# EAGLE schematic APRS_TRacker_2 (EAGLE 7.3.0)
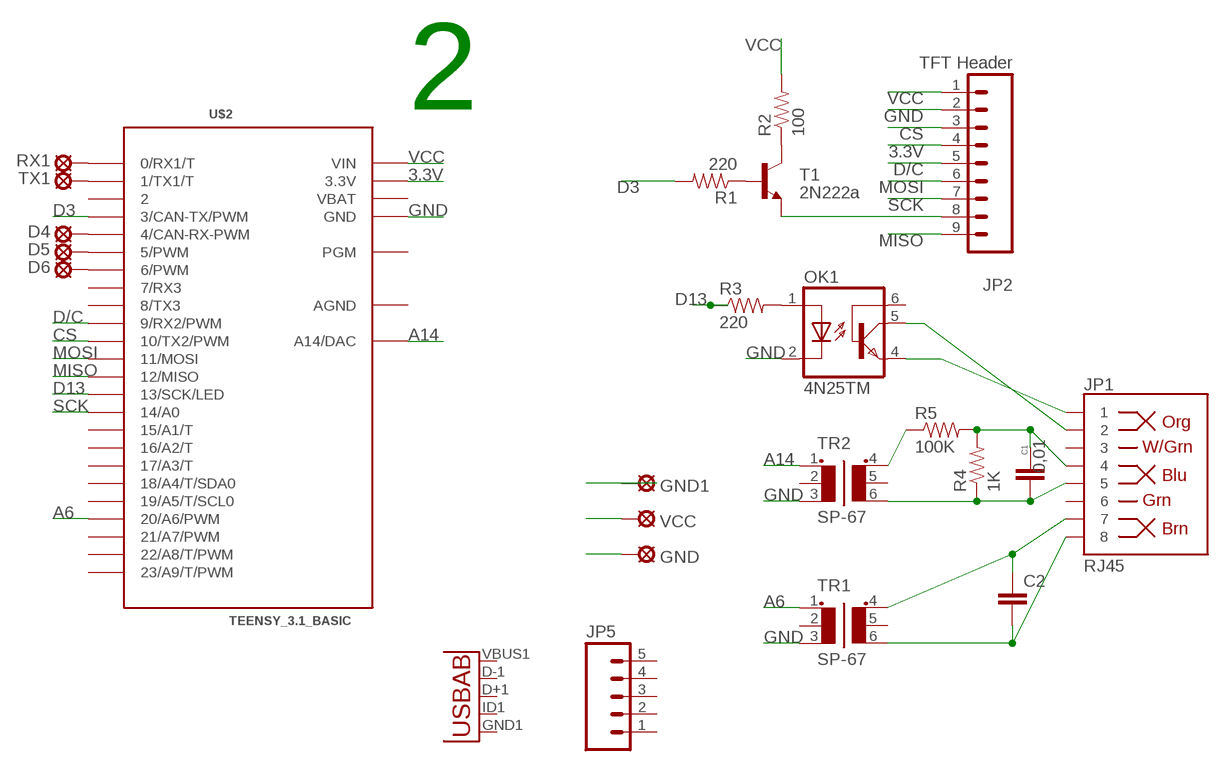
[diagram p0: schematic, sheet 1]

## Parts
C1  0,01  CAPPTH2  [CAP-PTH-SMALL2]
C2  CAPPTH2  [CAP-PTH-SMALL2]
D4  LSP10  [LSP10]
D5  LSP10  [LSP10]
D6  LSP10  [LSP10]
GND  LSP10  [LSP10]
GND1  LSP10  [LSP10]
JP1  RJ45  RJ45-8PTH  [RJ45-8]
JP2  TFT Header  M09  [1X09]
JP5  M05PTH  [1X05]
OK1  4N25TM  [DIL6-04]
R1  220  RESISTORPTH-1/4W  [AXIAL-0.4]
R2  100  RESISTORPTH-1/4W  [AXIAL-0.4]
R3  220  RESISTORPTH-1/4W  [AXIAL-0.4]
R4  1K  RESISTORPTH-1/4W  [AXIAL-0.4]
R5  100K  RESISTORPTH-1/4W  [AXIAL-0.4]
RX1  LSP10  [LSP10]
T1  2N222a  TRANSISTOR_NPNP2N2222A  [TO-92]
TR1  SP-67  [SP-67]
TR2  SP-67  [SP-67]
TX1  LSP10  [LSP10]
U$2  TEENSY_3.1_BASIC  [TEENSY_3.1_BASIC]
U$4  USB-AB""  [USB-AB-MICRO-SMD_V02_BOSS]
VCC  LSP10  [LSP10]

## Nets
3.3V: JP2.4 U$2.3.3V U$2.3.3V1(3.3V)
A6: TR1.1 U$2.20/A6(20/A6/PWM)
A14: TR2.1 U$2.A14(A14/DAC)
CS: JP2.3 U$2.10(10/TX2/PWM)
D3: R1.P$2 U$2.3(3/CAN-TX/PWM)
D13: R3.P$1 U$2.13(13/SCK/LED)
D/C: JP2.5 U$2.9(9/RX2/PWM)
GND: GND1.MP GND.MP JP2.2 OK1.2(C) TR1.3 TR2.3 U$2.GND U$2.GND1(GND)
MISO: JP2.9 U$2.12(12/MISO)
MOSI: JP2.6 U$2.11(11/MOSI)
N$1: R1.P$1 T1.2(B)
N$2: R2.P$1 T1.1(C)
N$3: OK1.1(A) R3.P$2
N$4: JP1.1 OK1.4(EMI)
N$5: JP1.2 OK1.5(COL)
N$6: C2.2 JP1.8 TR1.6
N$7: C2.1 JP1.7 TR1.4
N$8: C1.1 JP1.4 R4.P$2 R5.P$2
N$9: C1.2 JP1.5 R4.P$1 TR2.6
N$10: R5.P$1 TR2.4
N$11: D5.MP U$2.5(5/PWM)
N$12: D6.MP U$2.6(6/PWM)
N$13: D4.MP U$2.4(4/CAN-RX-PWM)
N$14: RX1.MP U$2.0(0/RX1/T)
N$15: TX1.MP U$2.1(1/TX1/T)
SCK: JP2.7 U$2.14/A0
T1: JP2.8 T1.3(E)
VCC: JP2.1 R2.P$2 U$2.VIN VCC.MP
Unconnected: JP1.3 JP1.6 JP5.1 JP5.2 JP5.3 JP5.4 JP5.5 OK1.6(BAS) TR1.2 TR1.5 TR2.2 TR2.5 U$2.2 U$2.7(7/RX3) U$2.8(8/TX3) U$2.15/A1(15/A1/T) U$2.16/A2(16/A2/T) U$2.17/A3(17/A3/T) U$2.18/A4(18/A4/T/SDA0) U$2.19/A5(19/A5/T/SCL0) U$2.21/A7(21/A7/PWM) U$2.22/A8(22/A8/T/PWM) U$2.23/A9(23/A9/T/PWM) U$2.PGM U$4.D+1(D+) U$4.D-1(D-) U$4.GND1(GND) U$4.ID1(USBID) U$4.VBUS1(VBUS)

## Notes on the sheet
- 2

## Power pins joined to a net without a drawn wire
AGND: U$2.AGND
VBAT: U$2.VBAT

## Library data of the parts
C1 C2 = SparkFun-Passives:CAP: Capacitor Standard 0603 ceramic capacitor, and 0.1" leaded capacitor.
D4-D6 GND GND1 RX1 TX1 VCC = solpad:LSP10: SOLDER PAD drill 1.0 mm, distributor Buerklin, 12H555
JP1 = SparkFun-Connectors:RJ45-8: RJ45 Jack Simple RJ45, 8-pin connection - connector for common Cat5, Cat5e, and Cat6 Ethernet cables. Footprint not yet proven in production. Connector sku is PRT-00643; Breakout PCB sku is BOB-00716.; PROD_ID: CONN-08506
JP2 = SparkFun-Connectors:M09: Header 9 Standard 9-pin 0.1" header. Use with straight break away headers (SKU : PRT-00116), right angle break away headers (PRT-00553), swiss pins (PRT-00743), machine pins (PRT-00117), and female headers (PRT-00115).
JP5 = SparkFun:M05: Header 5 Standard 5-pin 0.1" header. Use with straight break away headers (SKU : PRT-00116), right angle break away headers (PRT-00553), swiss pins (PRT-00743), machine pins (PRT-00117), and female headers (PRT-00115). Molex polarized connector foot print use with SKU : PRT-08230 with associated crimp pins and housings.
OK1 = optocoupler:4N*?M: General Purpose 6-Pin Phototransistor Optocouplers Source: http://www.fairchildsemi.com/ds/4N/4N35-M.pdf; OC_FARNELL: unknown; OC_NEWARK: unknown
R1-R5 = SparkFun-Passives:RESISTOR: Resistor Basic schematic elements and footprints for 0603, 1206, and PTH resistors.
T1 = SparkFun-DiscreteSemi:TRANSISTOR_NPN: Generic NPN BJT MMBT2222A - TRANS-08049 (SOT-23, 1A 40V) MPSA42 - TRANS-09116 (SOT-23, 500mA 300V) MMBT5088LT1G - TRANS-11160 (SOT-23, 50 mA 30V) BC547 - COM-08928 <http://www.sparkfun.com/products/8928> (TO-92 45V 100mA) (1.Collector 2.Base 3.Emitter) 2N3904 - COM-00521 <http://www.sparkfun.com/products/521> (TO-92 40V 200mA) (1.Emitter 2.Base 3.Collector) P2N2222A - COM-12852 <http://www.sparkfun.com/products/12852> (TO-92 40V 600mA) (1.Collector 2.Base 3.Emitter); PROD_ID: TRANS-09536
TR1 TR2 = trafo:SP-67: Audio Transformer MIL-T-27E High Reliability: Red Spec Series Source: www.triadmagnetics.com .. SP-67.pdf
U$2 = Teensy_3_Series_Board_v1.0:TEENSY_3.1_BASIC: Footprint for Teensy 3.1 board using all pin connections on the outer perimeter
U$4 = Testing:USB-AB: This is a USB AB connector that is compatible with USB OTG. i.e. this connector can serve as a host or device